# Altium schematic sheet 01_Power.SchDoc
size A4; SheetNumber: 2; SheetTotal: 4
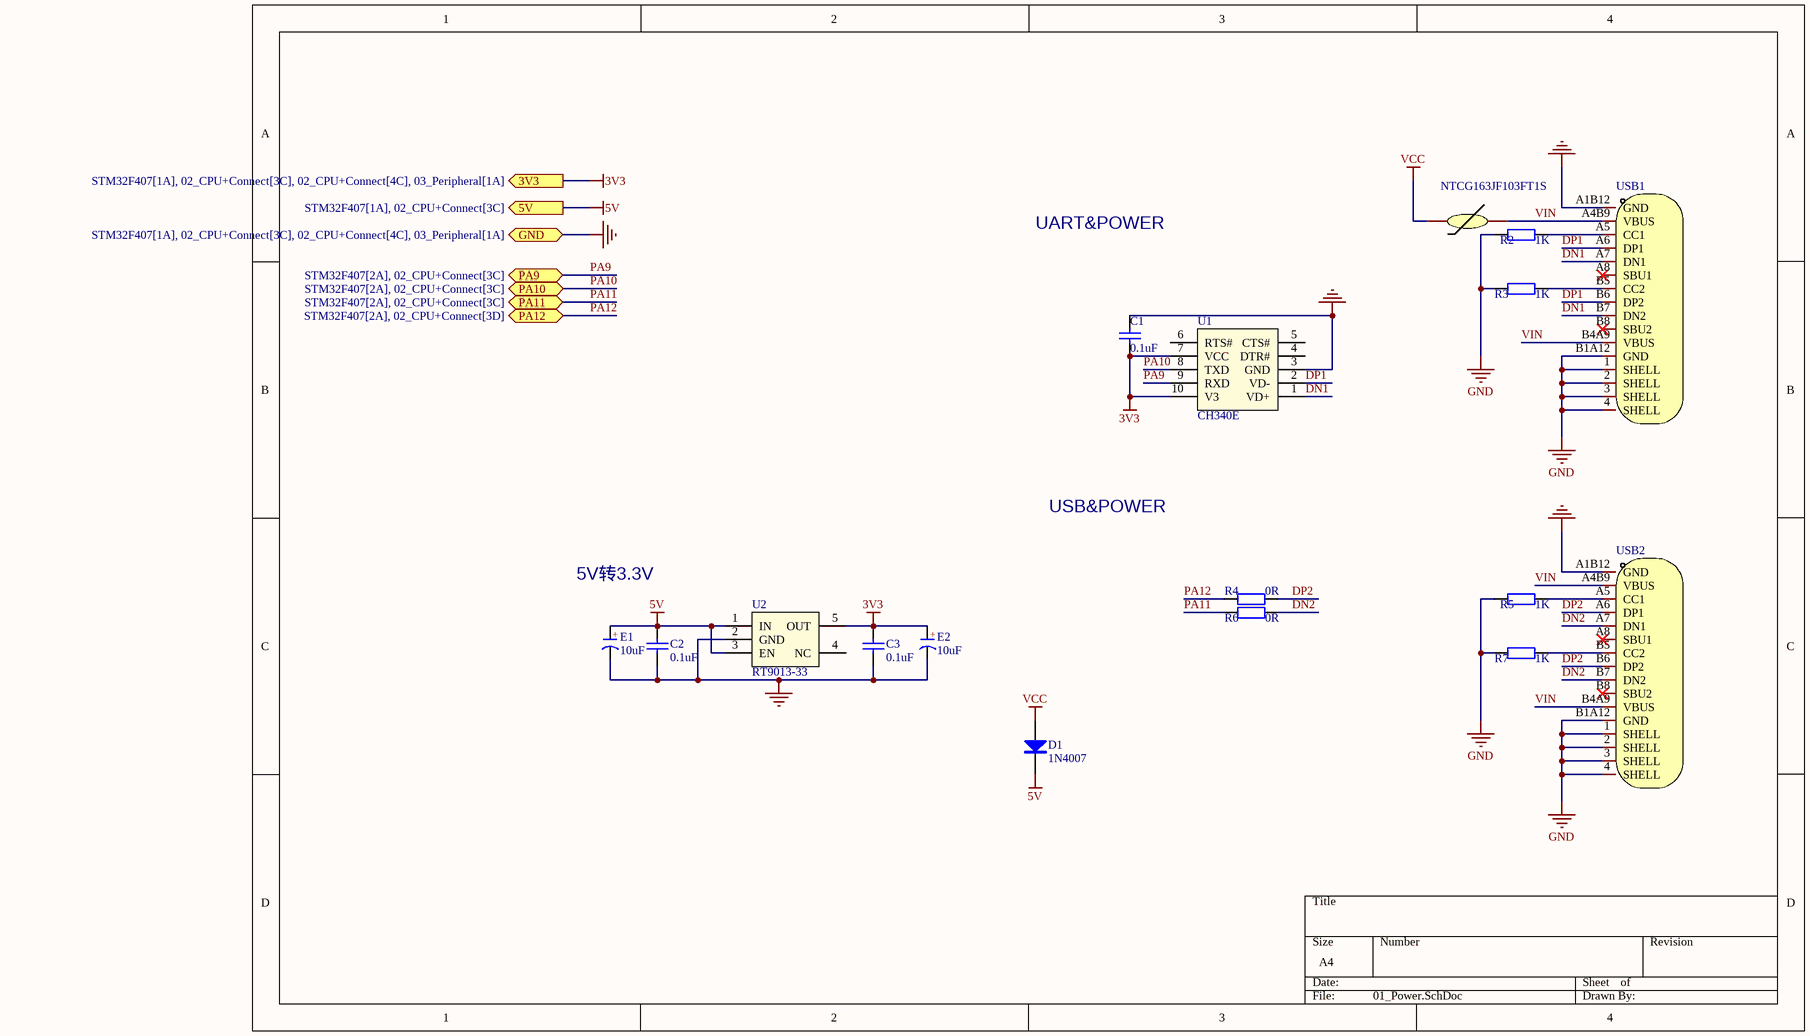
[diagram p0: 01_Power.SchDoc]

## Parts
C1  0.1uF  [C 0402_L]
C2  0.1uF  [C 0402_L]
C3  0.1uF  [C 0402_L]
D1  1N4007  [SOD-123]
E1  10uF  [CD A(3216)]
E2  10uF  [CD A(3216)]
R1  NTCG163JF103FT1S  [R0603]
R2  1K  [R 0402_L]
R3  1K  [R 0402_L]
R4  0R  [R 0402_L]
R5  1K  [R 0402_L]
R6  0R  [R 0402_L]
R7  1K  [R 0402_L]
U1  CH340E  [MSOP10_L]
U2  RT9013-33  [SOT23-5N]
USB1  TYPE-C 16P(073)  [USB-C-SMD_TYPE-C16PIN_C668624]  (value not drawn)
USB2  TYPE-C 16P(073)  [USB-C-SMD_TYPE-C16PIN_C668624]  (value not drawn)

## Ports
3V3 (out, see STM32F407[1A], 02_CPU+Connect[3C], 02_CPU+Connect[4C], 03_Peripheral[1A]), 5V (out, see STM32F407[1A], 02_CPU+Connect[3C]), GND (bidir, see STM32F407[1A], 02_CPU+Connect[3C], 02_CPU+Connect[4C], 03_Peripheral[1A]), PA9 (bidir, see STM32F407[2A], 02_CPU+Connect[3C]), PA10 (bidir, see STM32F407[2A], 02_CPU+Connect[3C]), PA11 (bidir, see STM32F407[2A], 02_CPU+Connect[3C]), PA12 (bidir, see STM32F407[2A], 02_CPU+Connect[3D])

## Nets
3V3: C1.2 C3.2 E2.1(A) U1.7(VCC) U1.10(V3) U2.5(OUT) ; port 3V3
5V: C2.2 D1.2(K) E1.1(A) U2.1(IN) U2.3(EN) ; port 5V
GND: C1.1 C2.1 C3.1 E1.2(K) E2.2(K) R2.1 R3.1 R5.1 R7.1 U1.3(GND) U2.2(GND) USB1.1(SHELL) USB1.2(SHELL) USB1.3(SHELL) USB1.4(SHELL) USB1.A1B12(GND) USB1.B1A12(GND) USB2.1(SHELL) USB2.2(SHELL) USB2.3(SHELL) USB2.4(SHELL) USB2.A1B12(GND) USB2.B1A12(GND) ; port GND
VCC: D1.1(A) R1.1
DN1: U1.1(VD+) USB1.A7(DN1) USB1.B7(DN2)
DN2: R6.1 USB2.A7(DN1) USB2.B7(DN2)
DP1: U1.2(VD-) USB1.A6(DP1) USB1.B6(DP2)
DP2: R4.1 USB2.A6(DP1) USB2.B6(DP2)
PA9: U1.9(RXD) ; port PA9
PA10: U1.8(TXD) ; port PA10
PA11: R6.2 ; port PA11
PA12: R4.2 ; port PA12
VIN: R1.2 USB1.A4B9(VBUS) USB1.B4A9(VBUS) USB2.A4B9(VBUS) USB2.B4A9(VBUS)
NetR2_2: R2.2 USB1.A5(CC1)
NetR3_2: R3.2 USB1.B5(CC2)
NetR5_2: R5.2 USB2.A5(CC1)
NetR7_2: R7.2 USB2.B5(CC2)

Not connected (* = marked no-connect by the designer): U1 4(DTR#) 5(CTS#) 6(RTS#); U2 4(NC); USB1 A8(SBU1)* B8(SBU2)*; USB2 A8(SBU1)* B8(SBU2)*

## Notes on the sheet
- UART&POWER
- USB&POWER
- 5V转3.3V
- (in symbol C-CD) +

## Library data of the parts
C1-C3 = Cap
D1 = 1N4007: 整流二极管; BOM名称: 整流二极管
E1 E2 = C-CD: 贴片钽电容; BOM名称: 贴片钽电容
R1 = NTCG163JF103FT1S: 阻值(25℃):10kΩ;电阻精度:±1%;B值精度:±1%;B值(25℃/50℃):3380K;功率:100mW;最大稳态电流(25℃):310uA;B值(25℃/75℃):3422K;B值(25℃/85℃):3435K;B值(25℃/100℃):3453K;工作温度:-40℃~+150℃;; Manufacturer: TDK; Add into BOM: yes; Resistance @ 25℃: 10kΩ; Resistance Tolerance: ±1%; B Constant (25℃/50℃): 3380K; Power: 100mW; Steady State Current (Max): 310uA; B Constant (25℃/75℃): 3422K; B Constant (25℃/85℃): 3435K; B Constant (25℃/100℃): 3453K; Symbol: NTCG163JF103FT1S; Device: NTCG163JF103FT1S; LCSC Part Name: 10kΩ 电阻精度:±1% 3380K; Supplier Part: C406719; Manufacturer Part: NTCG163JF103FT1S; Supplier Footprint: 0603; JLCPCB Part Class: 扩展库; Datasheet: https://atta.szlcsc.com/upload/public/pdf/source/20190723/C406719_56E4CA7886271F3E26D47484E1680181.pdf; Supplier: LCSC; Convert to PCB: yes; B Constant Tolerance: ±1%; Operating Temperature: -40℃~+150℃; Name: NTCG163JF103FT1S
R2-R7 = Res
USB1 USB2 = TYPE-C 16P(073): 连接器类型:Type-C;标准:-;公母:母座;触点数量:16;端口数量:1;安装方式:卧贴;额定电流 - 电源:5A;工作温度范围:-25℃~+85℃;; Manufacturer: SHOU HAN(首韩); Add into BOM: yes; Gender: 母座; Number of Contacts: 16; Number of Ports: 1; Mounting Sytle: 卧贴; Current Rating - Power (Max): 5A; Symbol: TYPE-C 16P(073); Device: TYPE-C 16P(073); LCSC Part Name: TYPE-C母座 16P 4脚插件带定位柱 不锈钢外壳 3次模顶; Supplier Part: C668624; Manufacturer Part: TYPE-C 16P(073); Supplier Footprint: SMD; JLCPCB Part Class: 扩展库; Datasheet: https://atta.szlcsc.com/upload/public/pdf/source/20200618/C668624_CC51EC37614090AAD56C1421DE954C80.pdf; Supplier: LCSC; Convert to PCB: yes; Connector Type: Type-C; Standard: -; Operating Temperature Range: -25℃~+85℃; NO_CONNECT: yes; Name: TYPE-C 16P(073)